# EAGLE schematic proxy (EAGLE 6.5.0)
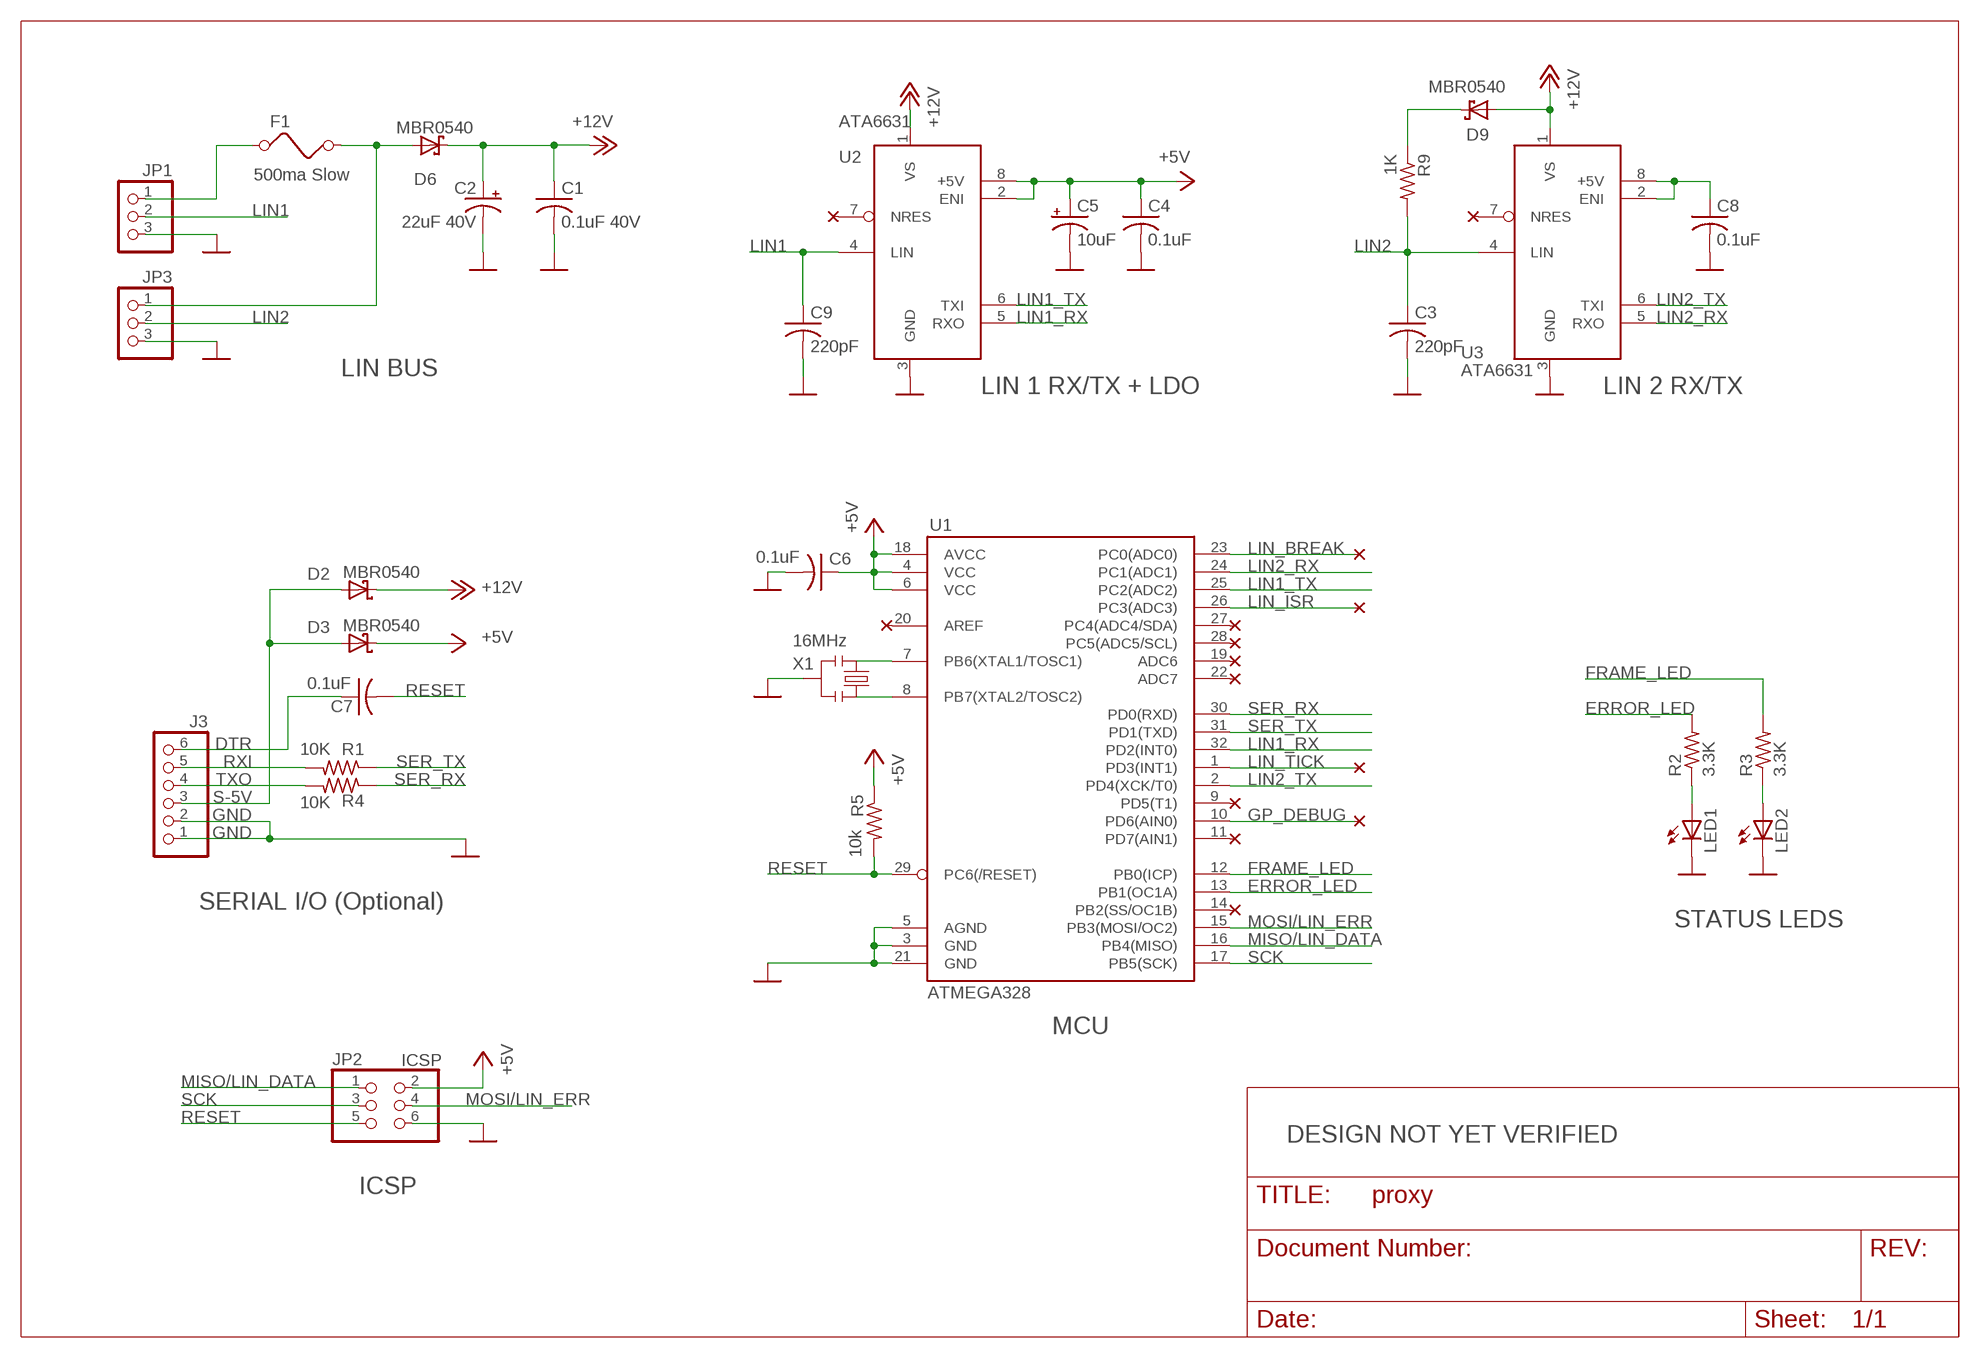
[diagram p0: schematic, sheet 1]

## Parts
C1  0.1uF 40V  C-USC0805  [C0805]
C2  22uF 40V  CPOL-USUD-6,3X5,8  [UD-6,3X5,8_NICHICON]
C3  220pF  C-USC0805  [C0805]
C4  0.1uF  C-USC0805  [C0805]
C5  10uF  CPOL-USA/3216-18R  [A/3216-18R]
C6  0.1uF  C-USC0805  [C0805]
C7  0.1uF  C-USC0805  [C0805]
C8  0.1uF  C-USC0805  [C0805]
C9  220pF  C-USC0805  [C0805]
D2  MBR0540  SMF5.0AT1  [SOD123FL]
D3  MBR0540  SMF5.0AT1  [SOD123FL]
D6  MBR0540  SMF5.0AT1  [SOD123FL]
D9  MBR0540  SMF5.0AT1  [SOD123FL]
F1  500ma Slow  FUSE  [1206]
J3  PINHD-1X6  [1X06]
JP1  PINHD-1X3  [1X03]
JP2  ICSP  PINHD-2X3  [2X03]
JP3  PINHD-1X3  [1X03]
LED1  LED  [1206-LED]
LED2  LED  [1206-LED]
R1  10K  R-US_R0805  [R0805]
R2  3.3K  R-US_R0805  [R0805]
R3  3.3K  R-US_R0805  [R0805]
R4  10K  R-US_R0805  [R0805]
R5  10k  R-US_R0805  [R0805]
R9  1K  R-US_R0805  [R0805]
U1  ATMEGA328  [TQFP32-08]
U2  ATA6631  [SO-08]
U3  ATA6631  [SO-08]
X1  16MHz  RESONATORSMD  [RESONATOR-SMD]

## Nets
+5V: C4.1 C5.+ C6.1 D3.C JP2.2 R5.1 U1.4(VCC) U1.6(VCC) U1.18(AVCC) U2.2(ENI) U2.8(+5V)
+12V: C1.1 C2.+ D2.C D6.C D9.A U2.1(VS) U3.1(VS)
DTR: C7.1 J3.6
ERROR_LED: R2.2 U1.13(PB1(OC1A))
FRAME_LED: R3.2 U1.12(PB0(ICP))
GND: C1.2 C2.- C3.2 C4.2 C5.- C6.2 C8.2 C9.2 J3.1 J3.2 JP1.3 JP2.6 JP3.3 LED1.C LED2.C U1.3(GND) U1.5(AGND) U1.21(GND) U2.3(GND) U3.3(GND) X1.2
GP_DEBUG: U1.10(PD6(AIN0))
LIN1: C9.1 JP1.2 U2.4(LIN)
LIN1_RX: U1.32(PD2(INT0)) U2.5(RXO)
LIN1_TX: U1.25(PC2(ADC2)) U2.6(TXI)
LIN2: C3.1 JP3.2 R9.2 U3.4(LIN)
LIN2_RX: U1.24(PC1(ADC1)) U3.5(RXO)
LIN2_TX: U1.2(PD4(XCK/T0)) U3.6(TXI)
LIN_BREAK: U1.23(PC0(ADC0))
LIN_ISR: U1.26(PC3(ADC3))
LIN_TICK: U1.1(PD3(INT1))
MISO/LIN_DATA: JP2.1 U1.16(PB4(MISO))
MOSI/LIN_ERR: JP2.4 U1.15(PB3(MOSI/OC2))
N$3: LED2.A R3.1
N$4: LED1.A R2.1
N$6: D6.A F1.2 JP3.1
N$9: D9.C R9.1
RESET: C7.2 JP2.5 R5.2 U1.29(PC6(/RESET))
RXI: J3.5 R1.2
S-5V: D2.A D3.A J3.3
SCK: JP2.3 U1.17(PB5(SCK))
SECONDARY_5V: C8.1 U3.2(ENI) U3.8(+5V)
SER_RX: R4.1 U1.30(PD0(RXD))
SER_TX: R1.1 U1.31(PD1(TXD))
TXO: J3.4 R4.2
VBAT: F1.1 JP1.1
XTAL1: U1.7(PB6(XTAL1/TOSC1)) X1.3
XTAL2: U1.8(PB7(XTAL2/TOSC2)) X1.1
Unconnected: U1.9(PD5(T1)) U1.11(PD7(AIN1)) U1.14(PB2(SS/OC1B)) U1.19(ADC6) U1.20(AREF) U1.22(ADC7) U1.27(PC4(ADC4/SDA)) U1.28(PC5(ADC5/SCL)) U2.7(NRES) U3.7(NRES)

## Notes on the sheet
- LIN BUS
- LIN 1 RX/TX + LDO | LIN 2 RX/TX
- SERIAL I/O (Optional)
- STATUS LEDS
- MCU
- DESIGN NOT YET VERIFIED
- ICSP

## Library data of the parts
C1 C3 C4 C6-C9 = proxy:C-US
C2 C5 = proxy:CPOL-US
D2 D3 D6 D9 = proxy:SMF5.0AT1
F1 = proxy:FUSE
J3 = proxy:PINHD-1X6
JP1 JP3 = proxy:PINHD-1X3
JP2 = proxy:PINHD-2X3
LED1 LED2 = proxy:LED
R1-R5 R9 = proxy:R-US_
U1 = proxy:ATMEGA328
U2 U3 = proxy:ATA6631
X1 = proxy:RESONATOR

## Net classes
1 vcc: width 0.254 mm